# EAGLE schematic UART Bluetooth (EAGLE 9.1.2)
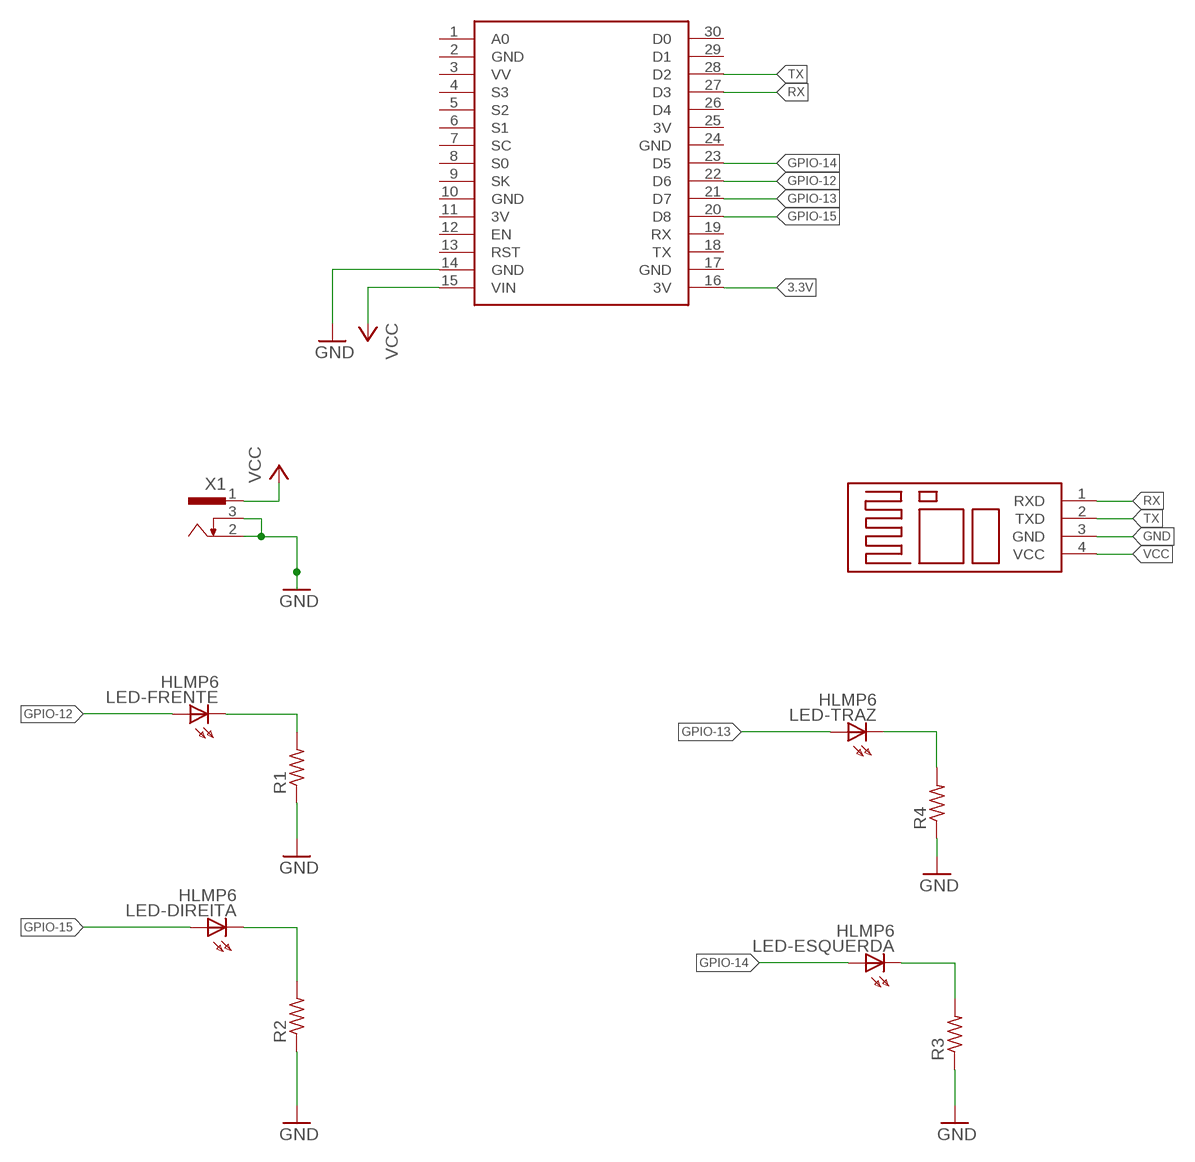
[diagram p0: schematic, sheet 1]

## Parts
B1  BLUETOOTH  [BLUETOOTH]
LED-DIREITA  HLMP6  [HLMP6]
LED-ESQUERDA  HLMP6  [HLMP6]
LED-FRENTE  HLMP6  [HLMP6]
LED-TRAZ  HLMP6  [HLMP6]
R1  R-US_0207/5V  [0207/5V]
R2  R-US_0207/5V  [0207/5V]
R3  R-US_0207/5V  [0207/5V]
R4  R-US_0207/5V  [0207/5V]
U$1  NODEMCU  [NODEMCU]
X1  SCD-014A  [SCD-014-A]

## Nets
3.3V: U$1.16(3V)
GND: B1.3(GND) R1.1 R2.1 R3.1 R4.1 U$1.14(GND) X1.2 X1.3
GPIO-12: LED-FRENTE.A U$1.22(D6)
GPIO-13: LED-TRAZ.A U$1.21(D7)
GPIO-14: LED-ESQUERDA.A U$1.23(D5)
GPIO-15: LED-DIREITA.A U$1.20(D8)
N$1: LED-FRENTE.K R1.2
N$2: LED-DIREITA.K R2.2
N$3: LED-TRAZ.K R4.2
N$4: LED-ESQUERDA.K R3.2
RX: B1.1(RXD) U$1.27(D3)
TX: B1.2(TXD) U$1.28(D2)
VCC: B1.4(VCC) U$1.15(VIN) X1.1
Unconnected: U$1.1(A0) U$1.3(VV) U$1.4(S3) U$1.5(S2) U$1.6(S1) U$1.7(SC) U$1.8(S0) U$1.9(SK) U$1.12(EN) U$1.13(RST) U$1.18(TX) U$1.19(RX) U$1.26(D4) U$1.29(D1) U$1.30(D0)

## Power pins joined to a net without a drawn wire
3V: U$1.11(3V) U$1.25(3V)
GND: U$1.2(GND) U$1.10(GND) U$1.17(GND) U$1.24(GND)

## Library data of the parts
B1 = HC 06 Bluetooth:BLUETOOTH
LED-DIREITA LED-ESQUERDA LED-FRENTE LED-TRAZ = display-hp:HLMP6: LED 2mm horizontal; MF: AGILENT TECHNOLOGIES; MPN: HLMP-6500; OC_FARNELL: 1652490; OC_NEWARK: 40K0088
R1-R4 = rcl:R-US_: RESISTOR, American symbol; SPICEPREFIX: R
U$1 = nodemcu:NODEMCU
X1 = con-shiua-chyuan:SCD-014A: Power Jack 2.5mm; OC_FARNELL: unknown; OC_NEWARK: unknown